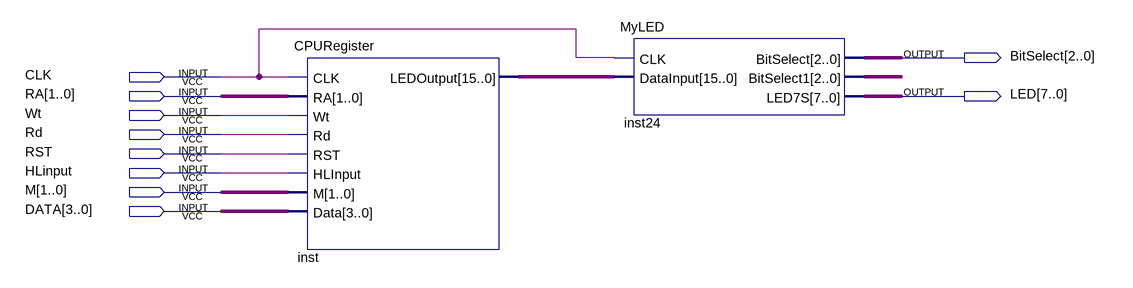
[diagram p0: schematic sheet]
// Quartus schematic TopLevelEntity.bdf as structural Verilog: 2 symbols, 10 pins
module TopLevelEntity (
  input  CLK,
  input  [1:0] RA,
  input  Wt,
  input  Rd,
  input  RST,
  input  HLinput,
  input  [1:0] M,
  input  [3:0] DATA,
  output [2:0] BitSelect,
  output [7:0] LED
);

  wire [2:0] inst24_bitselect1;
  wire [15:0] inst_ledoutput;

  CPURegister inst (
    .CLK(CLK), .RA(RA), .Wt(Wt), .Rd(Rd), .RST(RST), .HLInput(HLinput), .M(M), .Data(DATA),
    .LEDOutput(inst_ledoutput));
  MyLED inst24 (
    .CLK(CLK), .DataInput(inst_ledoutput), .BitSelect(BitSelect), .BitSelect1(inst24_bitselect1), .LED7S(LED));
endmodule
